# Altium schematic sheet 3_MCU_EPS.SchDoc: EPS MCU Main
size A3; DrawnBy: Sara V. Martínez; Engineer: Flight; DocumentNumber: 6; Revision: V0.1; SheetNumber: 6; SheetTotal: 11
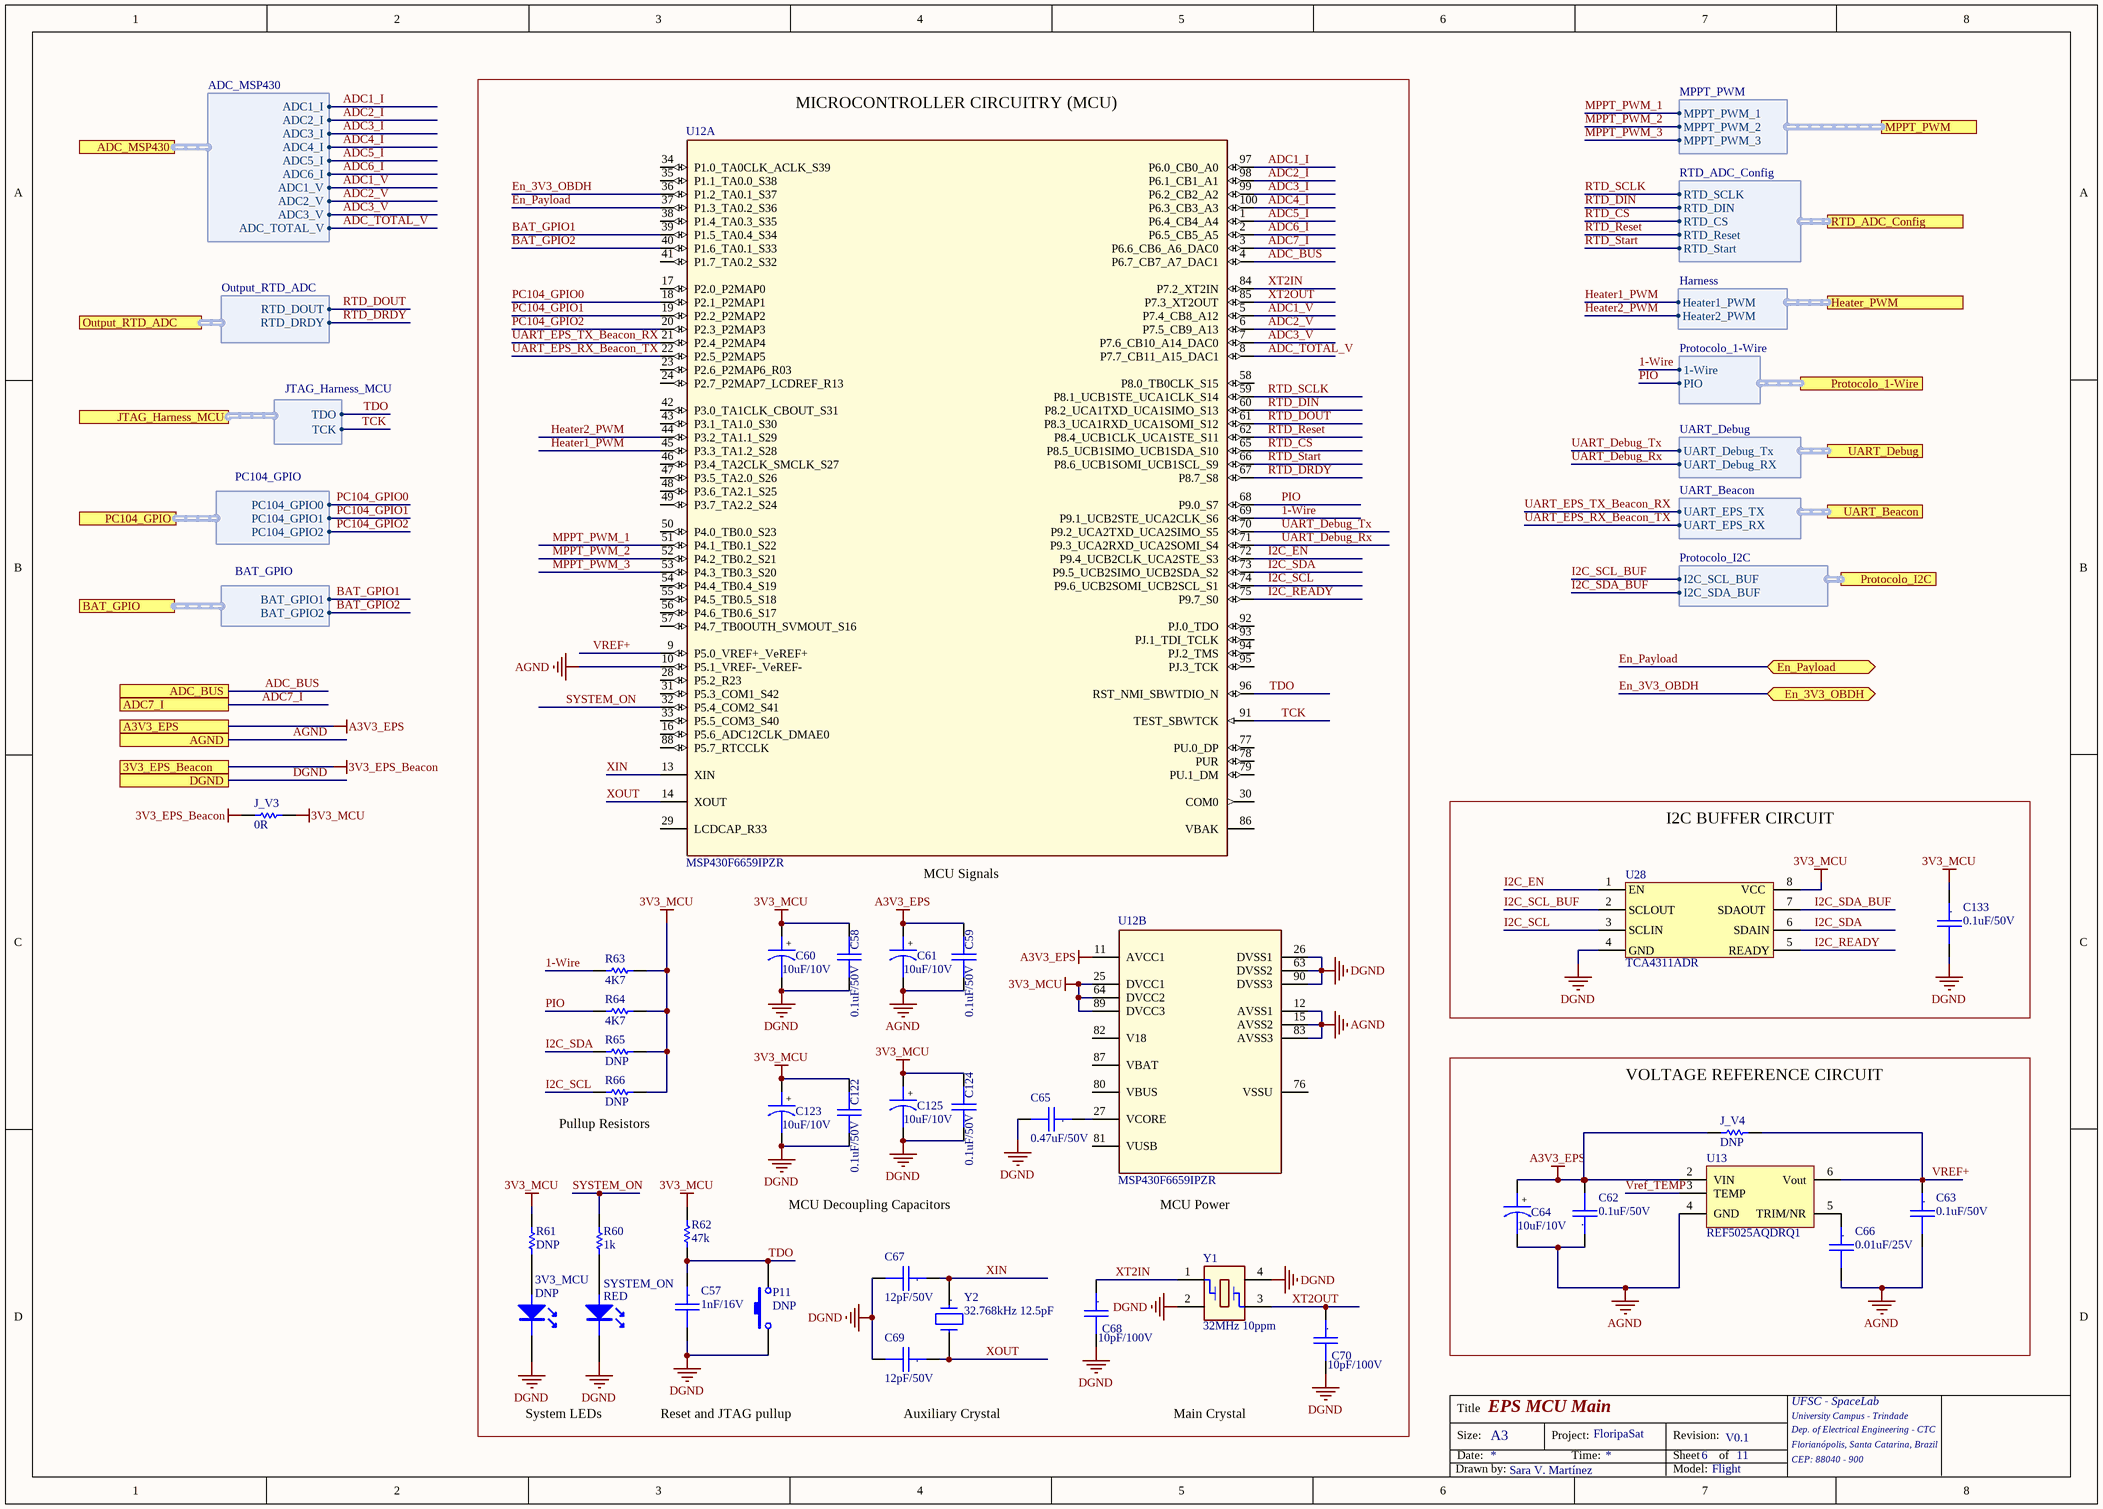
[diagram p0: 3_MCU_EPS.SchDoc]

## Parts
3V3_MCU  DNP  [0603-LED]
C57  1nF/16V  [CC0805]
C58  0.1uF/50V  [CC0603]
C59  0.1uF/50V  [CC0603]
C60  10uF/10V  [CC0805_Tantalum]
C61  10uF/10V  [CC0805_Tantalum]
C62  0.1uF/50V  [CC0805]
C63  0.1uF/50V  [CC0603]
C64  10uF/10V  [CC0805_Tantalum]
C65  0.47uF/50V  [CC0603]
C66  0.01uF/25V  [CC0603]
C67  12pF/50V  [CC0603]
C68  10pF/100V  [CC0805]
C69  12pF/50V  [CC0603]
C70  10pF/100V  [CC0805]
C122  0.1uF/50V  [CC0603]
C123  10uF/10V  [CC0805_Tantalum]
C124  0.1uF/50V  [CC0603]
C125  10uF/10V  [CC0805_Tantalum]
C133  0.1uF/50V  [CC0603]
J_V3  0R  [0805]
J_V4  DNP  [0805]
P11  DNP  [B3U-1000P]
R60  1k  [0603]
R61  DNP  [0603]
R62  47k  [0603]
R63  4K7  [0603]
R64  4K7  [0603]
R65  DNP  [0603]
R66  DNP  [0603]
SYSTEM_ON  RED  [0603-LED]
U12  MSP430F6659IPZR  [PZ0100A_N]  (parts A,B of 2)
U13  REF5025AQDRQ1  [SOIC-8]
U28  TCA4311ADR  [SOIC8]
Y1  32MHz 10ppm  [XTAL_ABM8X]
Y2  32.768kHz 12.5pF  [ABS06 0805]

## Blocks framed on the sheet
MICROCONTROLLER CIRCUITRY (MCU): 3V3_MCU C57-C61 C65 C67-C70 C122-C125 P11 R60-R66 SYSTEM_ON U12 Y1 Y2
I2C BUFFER CIRCUIT: C133 U28
VOLTAGE REFERENCE CIRCUIT: C62-C64 C66 J_V4 U13

## Ports
3V3_EPS_Beacon, A3V3_EPS, ADC7_I, ADC_BUS, ADC_MSP430 (harness ADC_MSP430), AGND, BAT_GPIO (harness BAT_GPIO), DGND, En_3V3_OBDH (bidir), En_Payload (bidir), Heater_PWM (harness Harness), JTAG_Harness_MCU (harness JTAG_Harness_MCU), MPPT_PWM (harness MPPT_PWM), Output_RTD_ADC (harness Output_RTD_ADC), PC104_GPIO (harness PC104_GPIO), Protocolo_1-Wire (harness Protocolo_1-Wire), Protocolo_I2C (harness Protocolo_I2C), RTD_ADC_Config (harness RTD_ADC_Config), UART_Beacon (harness UART_Beacon), UART_Debug (harness UART_Debug)

## Harnesses
ADC_MSP430: ADC1_I, ADC2_I, ADC3_I, ADC1_V, ADC2_V, ADC3_V, ADC_TOTAL_V, ADC4_I, ADC5_I, ADC6_I
MPPT_PWM: MPPT_PWM_1, MPPT_PWM_2, MPPT_PWM_3
Protocolo_1-Wire: 1-Wire, PIO
Output_RTD_ADC: RTD_DOUT, RTD_DRDY
RTD_ADC_Config: RTD_SCLK, RTD_DIN, RTD_CS, RTD_Reset, RTD_Start
JTAG_Harness_MCU: TDO, TCK
UART_Debug: UART_Debug_Tx, UART_Debug_RX
Protocolo_I2C: I2C_SCL_BUF, I2C_SDA_BUF
Harness: Heater1_PWM, Heater2_PWM
UART_Beacon: UART_EPS_TX, UART_EPS_RX
PC104_GPIO: PC104_GPIO0, PC104_GPIO1, PC104_GPIO2
BAT_GPIO: BAT_GPIO1, BAT_GPIO2

## Nets
3V3_EPS_Beacon: J_V3.2 ; port 3V3_EPS_Beacon
3V3_MCU: C58.1 C60.1 C122.1 C123.1 C124.1 C125.1 C133.1 J_V3.1 R61.2 R62.2 R63.1 R64.1 R65.1 R66.1 U12.25(DVCC1) U12.64(DVCC2) U12.89(DVCC3) U28.8(VCC)
A3V3_EPS: C59.1 C61.1 C62.2 C64.1 J_V4.2 U12.11(AVCC1) U13.2(VIN) ; port A3V3_EPS
AGND: C59.2 C61.2 C62.1 C63.2 C64.2 C66.2 U12.10(P5.1_VREF-_VeREF-) U12.12(AVSS1) U12.15(AVSS2) U12.83(AVSS3) U13.4(GND) ; port AGND
DGND: 3V3_MCU.2(K) C57.2 C58.2 C60.2 C65.2 C67.2 C68.2 C69.2 C70.2 C122.2 C123.2 C124.2 C125.2 C133.2 P11.1 SYSTEM_ON.2(K) U12.26(DVSS1) U12.63(DVSS2) U12.90(DVSS3) U28.4(GND) Y1.2 Y1.4 ; port DGND
1-Wire: R63.2 U12.69(P9.1_UCB2STE_UCA2CLK_S6) ; port Protocolo_1-Wire.1-Wire
ADC1_I: U12.97(P6.0_CB0_A0) ; port ADC_MSP430.ADC1_I
ADC1_V: U12.5(P7.4_CB8_A12) ; port ADC_MSP430.ADC1_V
ADC2_I: U12.98(P6.1_CB1_A1) ; port ADC_MSP430.ADC2_I
ADC2_V: U12.6(P7.5_CB9_A13) ; port ADC_MSP430.ADC2_V
ADC3_I: U12.99(P6.2_CB2_A2) ; port ADC_MSP430.ADC3_I
ADC3_V: U12.7(P7.6_CB10_A14_DAC0) ; port ADC_MSP430.ADC3_V
ADC4_I: U12.100(P6.3_CB3_A3) ; port ADC_MSP430.ADC4_I
ADC5_I: U12.1(P6.4_CB4_A4) ; port ADC_MSP430.ADC5_I
ADC6_I: U12.2(P6.5_CB5_A5) ; port ADC_MSP430.ADC6_I
ADC7_I: U12.3(P6.6_CB6_A6_DAC0) ; port ADC7_I
ADC_BUS: U12.4(P6.7_CB7_A7_DAC1) ; port ADC_BUS
ADC_TOTAL_V: U12.8(P7.7_CB11_A15_DAC1) ; port ADC_MSP430.ADC_TOTAL_V
BAT_GPIO1: U12.39(P1.5_TA0.4_S34) ; port BAT_GPIO.BAT_GPIO1
BAT_GPIO2: U12.40(P1.6_TA0.1_S33) ; port BAT_GPIO.BAT_GPIO2
En_3V3_OBDH: U12.36(P1.2_TA0.1_S37) ; port En_3V3_OBDH
En_Payload: U12.37(P1.3_TA0.2_S36) ; port En_Payload
Heater1_PWM: U12.45(P3.3_TA1.2_S28) ; port Heater_PWM.Heater1_PWM
Heater2_PWM: U12.44(P3.2_TA1.1_S29) ; port Heater_PWM.Heater2_PWM
I2C_EN: U12.72(P9.4_UCB2CLK_UCA2STE_S3) U28.1(EN)
I2C_READY: U12.75(P9.7_S0) U28.5(READY)
I2C_SCL: R66.2 U12.74(P9.6_UCB2SOMI_UCB2SCL_S1) U28.3(SCLIN)
I2C_SCL_BUF: U28.2(SCLOUT) ; port Protocolo_I2C.I2C_SCL_BUF
I2C_SDA: R65.2 U12.73(P9.5_UCB2SIMO_UCB2SDA_S2) U28.6(SDAIN)
I2C_SDA_BUF: U28.7(SDAOUT) ; port Protocolo_I2C.I2C_SDA_BUF
MPPT_PWM_1: U12.51(P4.1_TB0.1_S22) ; port MPPT_PWM.MPPT_PWM_1
MPPT_PWM_2: U12.52(P4.2_TB0.2_S21) ; port MPPT_PWM.MPPT_PWM_2
MPPT_PWM_3: U12.53(P4.3_TB0.3_S20) ; port MPPT_PWM.MPPT_PWM_3
PC104_GPIO0: U12.18(P2.1_P2MAP1) ; port PC104_GPIO.PC104_GPIO0
PC104_GPIO1: U12.19(P2.2_P2MAP2) ; port PC104_GPIO.PC104_GPIO1
PC104_GPIO2: U12.20(P2.3_P2MAP3) ; port PC104_GPIO.PC104_GPIO2
PIO: R64.2 U12.68(P9.0_S7) ; port Protocolo_1-Wire.PIO
RTD_CS: U12.65(P8.5_UCB1SIMO_UCB1SDA_S10) ; port RTD_ADC_Config.RTD_CS
RTD_DIN: U12.60(P8.2_UCA1TXD_UCA1SIMO_S13) ; port RTD_ADC_Config.RTD_DIN
RTD_DOUT: U12.61(P8.3_UCA1RXD_UCA1SOMI_S12) ; port Output_RTD_ADC.RTD_DOUT
RTD_DRDY: U12.67(P8.7_S8) ; port Output_RTD_ADC.RTD_DRDY
RTD_Reset: U12.62(P8.4_UCB1CLK_UCA1STE_S11) ; port RTD_ADC_Config.RTD_Reset
RTD_SCLK: U12.59(P8.1_UCB1STE_UCA1CLK_S14) ; port RTD_ADC_Config.RTD_SCLK
RTD_Start: U12.66(P8.6_UCB1SOMI_UCB1SCL_S9) ; port RTD_ADC_Config.RTD_Start
SYSTEM_ON: R60.2 U12.32(P5.4_COM2_S41)
TCK: U12.91(TEST_SBWTCK) ; port JTAG_Harness_MCU.TCK
TDO: C57.1 P11.2 R62.1 U12.96(RST_NMI_SBWTDIO_N) ; port JTAG_Harness_MCU.TDO
UART_Debug_Rx: U12.71(P9.3_UCA2RXD_UCA2SOMI_S4) ; port UART_Debug.UART_Debug_RX
UART_Debug_Tx: U12.70(P9.2_UCA2TXD_UCA2SIMO_S5) ; port UART_Debug.UART_Debug_Tx
UART_EPS_RX_Beacon_TX: U12.22(P2.5_P2MAP5) ; port UART_Beacon.UART_EPS_RX
UART_EPS_TX_Beacon_RX: U12.21(P2.4_P2MAP4) ; port UART_Beacon.UART_EPS_TX
VREF+: C63.1 J_V4.1 U12.9(P5.0_VREF+_VeREF+) U13.6(Vout)
Vref_TEMP: U13.3(TEMP)
XIN: C67.1 U12.13(XIN) Y2.1
XOUT: C69.1 U12.14(XOUT) Y2.2
XT2IN: C68.1 U12.84(P7.2_XT2IN) Y1.1
XT2OUT: C70.1 U12.85(P7.3_XT2OUT) Y1.3
Net3V3_MCU_1: 3V3_MCU.1(A) R61.1
NetC65_1: C65.1 U12.27(VCORE)
NetC66_1: C66.1 U13.5(TRIM/NR)
NetR60_1: R60.1 SYSTEM_ON.1(A)

Not connected (* = marked no-connect by the designer): U12 16(P5.6_ADC12CLK_DMAE0) 17(P2.0_P2MAP0) 23(P2.6_P2MAP6_R03) 24(P2.7_P2MAP7_LCDREF_R13) 28(P5.2_R23) 29(LCDCAP_R33) 30(COM0) 31(P5.3_COM1_S42) 33(P5.5_COM3_S40) 34(P1.0_TA0CLK_ACLK_S39) 35(P1.1_TA0.0_S38) 38(P1.4_TA0.3_S35) 41(P1.7_TA0.2_S32) 42(P3.0_TA1CLK_CBOUT_S31) 43(P3.1_TA1.0_S30) 46(P3.4_TA2CLK_SMCLK_S27) 47(P3.5_TA2.0_S26) 48(P3.6_TA2.1_S25) 49(P3.7_TA2.2_S24) 50(P4.0_TB0.0_S23) 54(P4.4_TB0.4_S19) 55(P4.5_TB0.5_S18) 56(P4.6_TB0.6_S17) 57(P4.7_TB0OUTH_SVMOUT_S16) 58(P8.0_TB0CLK_S15) 76(VSSU) 77(PU.0_DP) 78(PUR) 79(PU.1_DM) 80(VBUS) 81(VUSB) 82(V18) 86(VBAK) 87(VBAT) 88(P5.7_RTCCLK) 92(PJ.0_TDO) 93(PJ.1_TDI_TCLK) 94(PJ.2_TMS) 95(PJ.3_TCK)

## Notes on the sheet
- MCU Signals
- (near R66) Pullup Resistors
- MCU Decoupling Capacitors
- MCU Power
- System LEDs
- Reset and JTAG pullup
- Auxiliary Crystal
- Main Crystal
- Title
- Size:
- Date:
- A3
- Project:
- Time:
- FloripaSat
- Revision:
- Sheet
- of
- UFSC - SpaceLab
- University Campus - Trindade
- Dep. of Electrical Engineering - CTC
- Florianópolis, Santa Catarina, Brazil
- CEP: 88040 - 900
- Drawn by:
- Model:
- (in symbol Cap_Cer_X7R_0.01uF_25V_0603) .
- (in symbol Cap_Cer_X7R_0.1uF_25V_0805) .
- (in symbol Cap_Cer_X7R_0.1uF_50V_0603) .
- (in symbol Cap_Cer_X7R_0.47uF_50V_0603) .
- (in symbol Cap_Cer_X7R_1nF_16V_0603) .
- (in symbol Cap_Cer_X7R_10pF_100V_0805) .
- (in symbol Cap_Cer_X7R_12pF_50V_0603) .
- (in symbol Cap_Tant_SMD_10uF_6V3_0805) +
- (in symbol Xtal_32.768kHz_12pF_2_SMD) .

## Library data of the parts
3V3_MCU = LED/G_0603: SMD Green LED; Partnumber: 150060VS75000; NCM: 8541.40.21
C57 = Cap_Cer_X7R_1nF_16V_0603: CAP CER 1nF 16V 0603 5%; Partnumber: C0603X102J4RECAUTO; NCM: 8532.24.10
C58 C59 C63 C122 C124 C133 = Cap_Cer_X7R_0.1uF_50V_0603: CAP CER 0.1UF 50V 10% X7R 0603; Partnumber: CC0603KPX7R9BB104
C60 C61 C64 C123 C125 = Cap_Tant_SMD_10uF_6V3_0805: CAP Tantalum 10uF 6.3V 10% 0805; Partnumber: TPSR106K006R1000; NCM: 8532.21.11
C62 = Cap_Cer_X7R_0.1uF_25V_0805: CAP CER 0.1UF 50V 10% X7R 0805; Partnumber: GRM188R71H104KA93D; NCM: 8532.24.10
C65 = Cap_Cer_X7R_0.47uF_50V_0603: CAP CER 0.47UF 50V 10% X7R 0603; Partnumber: C1608X7R1H474K080AE; NCM: 8532.24.10
C66 = Cap_Cer_X7R_0.01uF_25V_0603: CAP CER 0.01UF 25V 5% X7R 0603; Partnumber: 06033C103JAT4A; NCM: 8532.24.10
C67 C69 = Cap_Cer_X7R_12pF_50V_0603: CAP CER 12pF 50V 0603; Partnumber: GQM1885C1H120GB01D; NCM: 8532.24.10
C68 C70 = Cap_Cer_X7R_10pF_100V_0805: CAP CER 10pF 100V 0805; Partnumber: 08051A100FAT2A; NCM: 8532.24.10
J_V3 J_V4 = R0R_JUMPER_1/8W_0805: RES 0R OHM 1/8W JUMPER 0805; Partnumber: CRCW08050000Z0EA
P11 = Tactile_Switches_B3U-1000P: Tactile Switch SPST-NO Top Actuated Surface Mount 12V 0.05A; Manufacturer: TE Connectivity; Partnumber: B3U-1000P
R60 R61 = R1.0k_1%_1/8W_0603: RES 1.0K OHM 1/8W 1% 0603; Partnumber: MCT06030C1001FP500; NCM: 8533.21.20
R62 = R47k_1%_1/8W_0603: RES 47K OHM 1/8W 0.5% 0603; Partnumber: MCT0603MD4702DP500; NCM: 8533.21.20
R63 R64 = R4.7K_1%_1/8W_0603: RES 4K7 OHM 1/8W 1% 0603; Partnumber: MCT06030C4701FP500; NCM: 8533.21.20
R65 R66 = R10k_1%_1/8W_0603: RES 10K OHM 1/8W 1%  0603; Partnumber: MCT0603MC1002FP500; NCM: 8533.21.20
SYSTEM_ON = LED/R_0603: SMD Red LED; Partnumber: LTST-C191KFKT; NCM: 8541.40.21
U12 = MSP430F6659IPZR: Imported; Manufacturer: Texas Instruments; CompType: IC; PIN_COUNT: 100; Application_BuildNumber: *; PartNumber: MSP430F6659IPZR; Alternate PartNumber: MSP430F6659IPZ; PackageReference: PZ0100A; MountType: SMT; RoHS: Y; RefDes: RefDes; Type: DEV; Value: Value
U13 = REF5025A-Q1: Partnumber: REF5025AQDRQ1
U28 = TCA4311ADR: IC SIGNAL BUFFER I2C 8SOIC; Partnumber: TCA4311ADR
Y1 = XTAL_32MHz_SMD_4-SMD: 32MHz ±10ppm Crystal 10pF 60 Ohm -40°C ~ 125°C; Partnumber: ABM8X-102-32.000MHZ-T; NCM: 8541.60.10
Y2 = Xtal_32.768kHz_12pF_2_SMD: 32.768kHz ±20ppm Crystal 12.5pF 70 kOhm -40°C ~ 125°C; Partnumber: ECS-.327-12.5-34S-TR; NCM: 8541.60.10